# EAGLE design driver board (EAGLE 9.3.1)
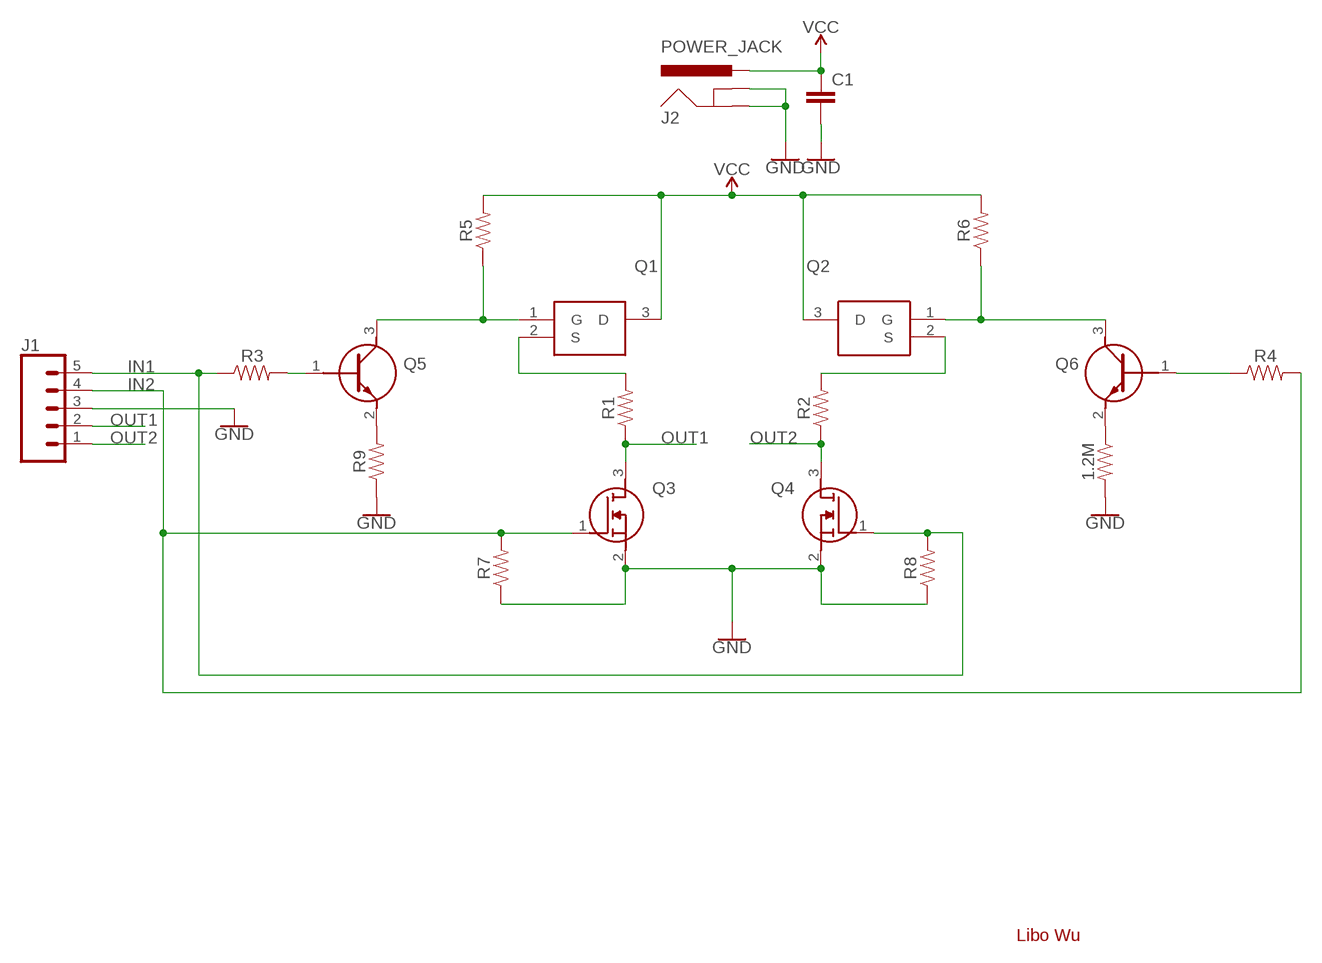
[diagram p0: schematic, sheet 1]

## Parts
C1  10nF  10NF-0603-50V-10%  [0603]
J1  CONN_05  [1X05]
J2  POWER_JACK  [POWER_JACK_PTH]
Q1  IRLML6401TRPBF  [SOT95P237X112-3N]
Q2  IRLML6401TRPBF  [SOT95P237X112-3N]
Q3  IRLML2502TRPBF  [SOT95P237X112-3N]
Q4  IRLML2502TRPBF  [SOT95P237X112-3N]
Q5  BCW66HQTA  [FMMT619TA]
Q6  BCW66HQTA  [FMMT619TA]
R1  1.2M  1.2MOHM-0603-1/10W-1%  [0603]
R2  1.2M  1.2MOHM-0603-1/10W-1%  [0603]
R3  1.2M  1.2MOHM-0603-1/10W-1%  [0603]
R4  1.2M  1.2MOHM-0603-1/10W-1%  [0603]
R5  1.2M  1.2MOHM-0603-1/10W-1%  [0603]
R6  1.2M  1.2MOHM-0603-1/10W-1%  [0603]
R7  1.2M  1.2MOHM-0603-1/10W-1%  [0603]
R8  1.2M  1.2MOHM-0603-1/10W-1%  [0603]
R9  1.2M  1.2MOHM-0603-1/10W-1%  [0603]
R10  1.2M  1.2MOHM-0603-1/10W-1%  [0603]

## Nets
GND: C1.2 J1.3 J2.GND J2.GNDBREAK Q3.2(S) Q4.2(S) R7.1 R8.1 R9.1 R10.2
IN1: J1.5 Q4.1(G) R3.1 R8.2
IN2: J1.4 Q3.1(G) R4.2 R7.2
N$2: Q1.2(S) R1.2
N$3: Q2.2(S) R2.2
N$7: Q2.1(G) Q6.3(C) R6.1
N$8: Q6.2(E) R10.1
N$9: Q6.1(B) R4.1
N$10: Q5.2(E) R9.2
N$11: Q1.1(G) Q5.3(C) R5.1
N$12: Q5.1(B) R3.2
OUT1: J1.2 Q3.3(D) R1.1
OUT2: J1.1 Q4.3(D) R2.1
VCC: C1.1 J2.PWR Q1.3(D) Q2.3(D) R5.2 R6.2

## Notes on the sheet
- Libo Wu

## Library data of the parts
C1 = SparkFun-Capacitors:10NF: 0.01uF/10nF/10,000pF ceramic capacitors A capacitor is a passive two-terminal electrical component used to store electrical energy temporarily in an electric field. CAP-09321; PROD_ID: CAP-00867
J1 = SparkFun-Connectors:CONN_05: Multi connection point. Often used as Generic Header-pin footprint for 0.1 inch spaced/style header connections On any of the 0.1 inch spaced packages, you can populate with these: Break Away Headers - Straight <https://www.sparkfun.com/products/116> (PRT-00116) Break Away Male Headers - Right Angle <https://www.sparkfun.com/products/553> (PRT-00553) Female Headers <https://www.sparkfun.com/products/115> (PRT-00115) Break Away Headers - Machine Pin <https://www.sparkfun.com/products/117> (PRT-00117) Break Away Female Headers - Swiss Machine Pin <https://www.sparkfun.com/products/743> (PRT-00743) For SCREWTERMINALS and SPRING TERMINALS visit here: Screw Terimnals on SparkFun.com <https://www.sparkfun.com/search/results?term=Screw+Terminals> (5mm/3.5mm/2.54mm spacing) This device is also useful as a general connection point to wire up your design to another part of your project. Our various solder wires solder well into these plated through hole pads. Hook-Up Wire - Assortment (Stranded, 22 AWG) <https://www.sparkfun.com/products/11375> (PRT-11375) Hook-Up Wire - Assortment (Solid Core, 22 AWG) <https://www.sparkfun.com/products/11367> (PRT-11367) View the entire wire category on our website here <https://www.sparkfun.com/categories/141> Special notes: Molex polarized connector foot print use with SKU : PRT-08231 with associated crimp pins and housings. 1MM SMD Version SKU: PRT-10208
J2 = SparkFun-Connectors:POWER_JACK: Power Jack Connector This is the standard 5.5mm barrel jack for power. The PTH is the most common, proven, reliable, footprint. The Slot footprint only works if the mill layer is transmitted to the PCB fab house so be warned. Here are the connectors we sell at SparkFun: DC Barrel Power Jack/Connector <https://www.sparkfun.com/products/119> (PRT-00119) DC Barrel Power Jack/Connector (SMD) <https://www.sparkfun.com/products/12748> (PRT-12748) DC Barrel Jack Adapter - Breadboard Compatible <https://www.sparkfun.com/products/10811> (PRT-10811) It is used on this SparkFun product (and many, many others): SparkFun RedBoard - Programmed with Arduino <https://www.sparkfun.com/products/12757> (DEV-12757) Also, if you need a mating power supply or connector, please check these out: Wall Adapter Power Supply - 9VDC 650mA <https://www.sparkfun.com/products/298> (TOL-00298) DC Barrel Jack Adapter - Male <https://www.sparkfun.com/products/10287> (PRT-10287); PROD_ID: CONN-08197
Q1 Q2 = SamacSys_Parts:IRLML6401TRPBF: INFINEON - IRLML6401TRPBF - MOSFET, P, MICRO3 Source: Datasheet <https://componentsearchengine.com/Datasheets/1/IRLML6401TRPBF.pdf>; DESCRIPTION: INFINEON - IRLML6401TRPBF - MOSFET, P, MICRO3; HEIGHT: 1.12mm; MANUFACTURER_NAME: Infineon; MANUFACTURER_PART_NUMBER: IRLML6401TRPBF; MOUSER_PART_NUMBER: 942-IRLML6401TRPBF; MOUSER_PRICE-STOCK: https://www.mouser.com/Search/Refine.aspx?Keyword=942-IRLML6401TRPBF
Q3 Q4 = SamacSys_Parts:IRLML2502TRPBF: IRLML2502TRPBF N-Channel MOSFET, 4.2 A, 20 V IRLML2502, 3-Pin SOT-23 Infineon Source: Datasheet <https://componentsearchengine.com/Datasheets/1/IRLML2502TRPBF.pdf>; DESCRIPTION: IRLML2502TRPBF N-Channel MOSFET, 4.2 A, 20 V IRLML2502, 3-Pin SOT-23 Infineon; HEIGHT: 1.12mm; MANUFACTURER_NAME: Infineon; MANUFACTURER_PART_NUMBER: IRLML2502TRPBF; MOUSER_PART_NUMBER: 942-IRLML2502TRPBF; MOUSER_PRICE-STOCK: https://www.mouser.com/Search/Refine.aspx?Keyword=942-IRLML2502TRPBF
Q5 Q6 = SamacSys_Parts:BCW66HQTA: Bipolar Transistors - BJT General Purpose Transistor Source: Datasheet <https://componentsearchengine.com/Datasheets/1/BCW66HQTA.pdf>; DESCRIPTION: Bipolar Transistors - BJT General Purpose Transistor; HEIGHT: mm; MANUFACTURER_NAME: Diodes Inc.; MANUFACTURER_PART_NUMBER: BCW66HQTA; MOUSER_PART_NUMBER: 621-BCW66HQTA; MOUSER_PRICE-STOCK: https://www.mouser.com/Search/Refine.aspx?Keyword=621-BCW66HQTA
R1-R10 = SparkFun-Resistors:1.2MOHM: 1.2MΩ resistor A resistor is a passive two-terminal electrical component that implements electrical resistance as a circuit element. Resistors act to reduce current flow, and, at the same time, act to lower voltage levels within circuits. - Wikipedia; PROD_ID: RES-10055

## Board
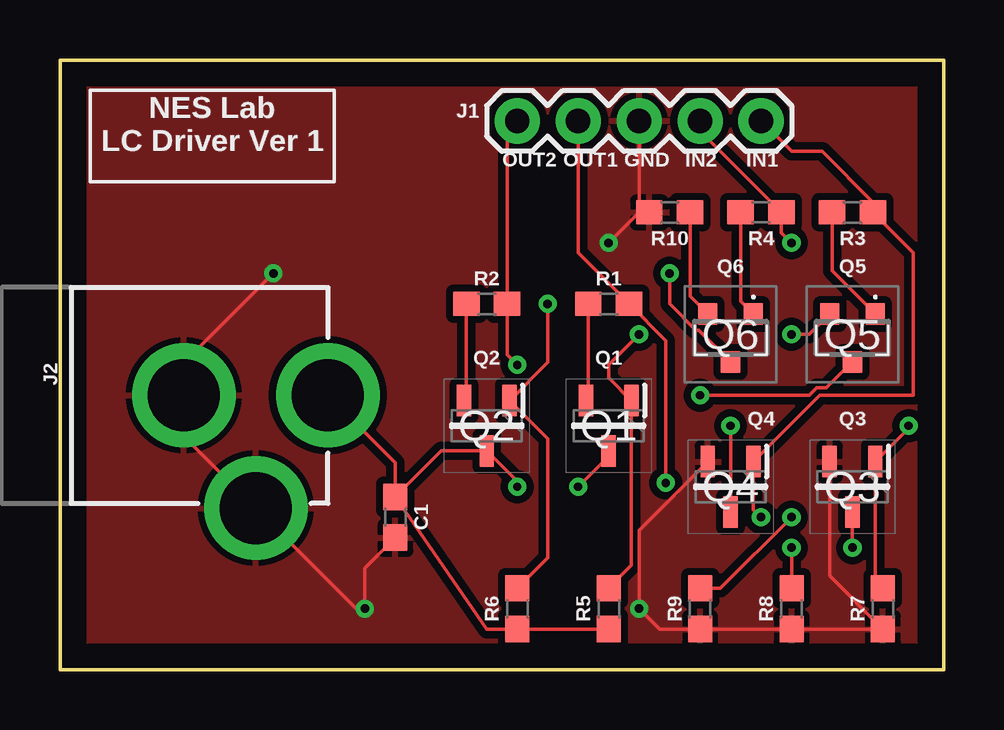
[diagram p1: board, top side]
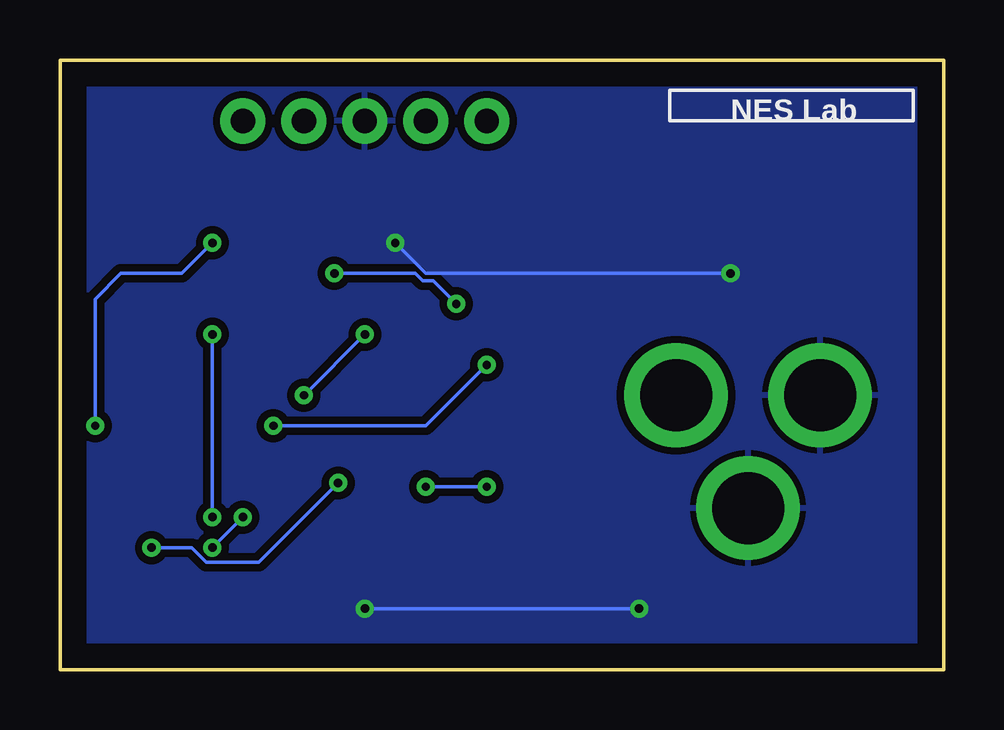
[diagram p2: board, bottom side, seen from below]

Size 36.83 x 25.4 mm. Coordinates in mm from the lower left corner, seen from the top.
Outline: 0,0 36.81,0 36.81,25.07
Outline: 0,25.07 0,0
Outline: 0,0 0,25.4 36.83,25.4 36.83,0 0,0
Copper layers (1*16): Top 0.035mm / dielectric 1.5mm / Bottom 0.035mm
Design rules "default": minimum track width 6mil, minimum drill 0.35mm, track to track 6mil, track to pad 6mil, pad to pad 6mil, via to via 6mil, smd to smd 6mil, copper to edge 40mil, drill to drill 6mil, minimum pad ring 10mil, minimum via ring 8mil, stop-mask expansion 4mil, vias tented up to drill 0mil, thermal gap 10mil

### Footprints (pad centres in the part's own frame; a part is rotated, then mirrored left to right if it is on the bottom)
0603 = smd 1.1 x 1: 1 -0.85,0; 2 0.85,0
1X05 = drill 1.016 pad 1.88: 1 0,0; 2 2.54,0; 3 5.08,0; 4 7.62,0; 5 10.16,0
POWER_JACK_PTH = drill 2.997 pad 4.318: GND 0,7.7; GNDBREAK 4.7,10.7; PWR 0,13.7
SOT95P237X112-3N = smd 1.3 x 0.6: 1 -1.05,0.95; 2 -1.05,-0.95; 3 1.05,0
FMMT619TA = smd 0.8 x 0.9: 1 -0.95,-0.85; 2 0.95,-0.85; 3 0,1.15

### Placement (x,y rotation side)
C1  13.97,6.35 270 top
J1  19.05,22.86 0 top
J2  -2.54,11.43 270 top
Q1  22.86,10.16 270 top
Q2  17.78,10.16 270 top
Q3  33.02,7.62 270 top
Q4  27.94,7.62 270 top
Q5  33.02,13.97 180 top
Q6  27.94,13.97 180 top
R1  22.86,15.24 180 top
R2  17.78,15.24 180 top
R3  33.02,19.05 180 top
R4  29.21,19.05 0 top
R5  22.86,2.54 270 top
R6  19.05,2.54 270 top
R7  34.29,2.54 90 top
R8  30.48,2.54 90 top
R9  26.67,2.54 90 top
R10  25.4,19.05 180 top

### Tracks (layer width: path | path; a pad name or v marks a point on that pad's centre or on a via)
GND  (via drill 0.35)
  Top 0.152: J1.3 24.13,19.47 R10.2 24.13,19.05 v22.86,17.78 | Q4.2 24.13,5.81 v24.13,2.54 24.98,1.69 R9.1 R8.1 R7.1 32.07,3.91 Q3.2 | C1.2 12.7,4.23 v12.7,2.54 12.35,2.54 J2.GNDBREAK 5.16,9.73 J2.GND 5.16,12.78 v8.89,16.51
  Bottom 0.152: v12.7,2.54 v24.13,2.54 | v22.86,17.78 21.59,16.51 v8.89,16.51
  pour Top (isolate 0.305): 0,25.4 36.83,25.4 36.83,0 0,0
  pour Bottom (isolate 0.305): 0,25.4 36.83,25.4 36.83,0 0,0
IN1  (via drill 0.35)
  Top 0.152: J1.5 30.48,21.59 31.75,21.59 33.87,19.47 R3.1 35.56,17.36 35.56,11.43 31.65,11.43 Q4.1 28.89,6.67 v29.21,6.35 | v30.48,5.08 R8.2
  Bottom 0.152: v29.21,6.35 v30.48,5.08
IN2  (via drill 0.35)
  Top 0.152: J1.4 26.67,22.44 R4.2 30.06,18.2 v30.48,17.78 | R7.2 33.97,3.71 Q3.1 35.36,10.06 v35.36,10.16
  Bottom 0.152: v30.48,17.78 31.75,16.51 34.29,16.51 35.36,15.44 v35.36,10.16
N$2
  Top 0.152: R1.2 22.01,11.31 Q1.2
N$3
  Top 0.152: R2.2 16.93,11.31 Q2.2
N$7  (via drill 0.35)
  Top 0.152: R6.1 20.32,4.66 20.32,9.62 Q2.1 20.32,12.8 v20.32,15.24 | Q6.3 26.62,14.14 26.49,14.14 25.4,15.24 v25.4,16.51
  Bottom 0.152: v20.32,15.24 21.29,16.2 21.72,16.2 22.02,16.51 v25.4,16.51
N$8
  Top 0.152: R10.1 26.25,15.56 Q6.2
N$9
  Top 0.152: R4.1 28.36,15.35 Q6.1
N$10  (via drill 0.35)
  Top 0.152: Q5.2 31.22,13.97 v30.48,13.97 | v30.48,6.35 27.52,3.39 R9.2
  Bottom 0.152: v30.48,13.97 v30.48,6.35
N$11  (via drill 0.35)
  Top 0.152: R5.1 23.81,4.34 Q1.1 22.86,12.16 22.86,12.7 v24.13,13.97 | Q5.3 31.93,11.73 31.52,11.73 31.22,11.43 v26.67,11.43
  Bottom 0.152: v26.67,11.43 v26.66,11.43 v24.13,13.97
N$12
  Top 0.152: R3.2 32.17,16.62 Q5.1
OUT1  (via drill 0.35)
  Top 0.152: v25.24,7.78 25.24,13.71 R1.1 21.59,17.36 J1.2 | v33.02,5.08 Q3.3
  Bottom 0.152: v33.02,5.08 31.34,5.08 30.73,4.47 28.55,4.47 v25.24,7.78
OUT2  (via drill 0.35)
  Top 0.152: Q4.3 v27.94,10.16 | v19.05,12.7 18.63,13.12 R2.1 18.63,22.44 J1.1
  Bottom 0.152: v27.94,10.16 21.59,10.16 v19.05,12.7
VCC  (via drill 0.35)
  Top 0.152: C1.1 17.78,1.69 R6.2 R5.2 | J2.PWR 13.97,8.62 C1.1 | C1.1 15.88,9.11 Q2.3 19.05,7.84 v19.05,7.62 | v21.59,7.62 22.86,8.89 Q1.3
  Bottom 0.152: v19.05,7.62 v21.59,7.62

### Text on the board
tPlace: NES Lab / LC Driver Ver 1 | OUT2 | OUT1 | GND | IN2 | IN1 | Q6 | Q5 | Q2 | Q1 | Q4 | Q3
bPlace: NES Lab